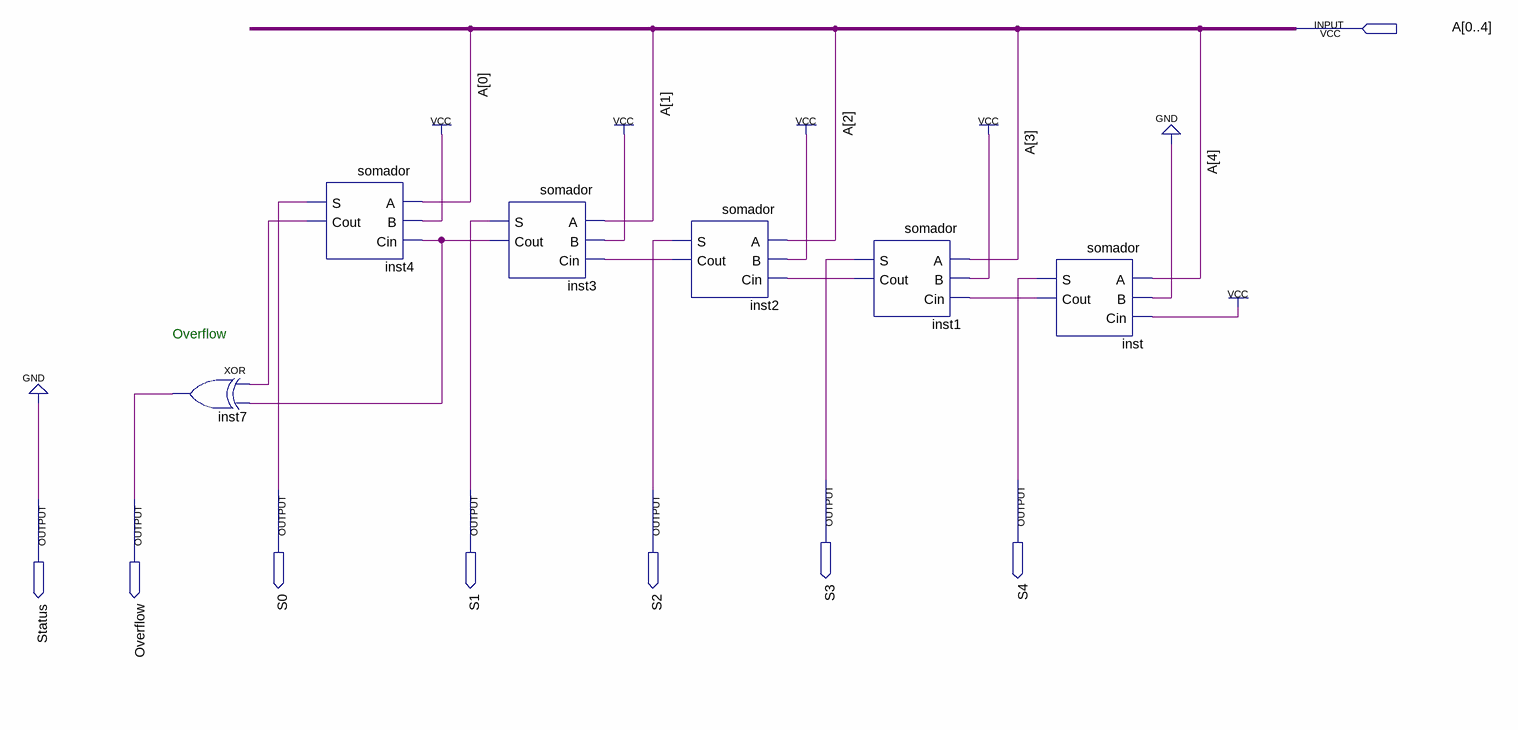
[diagram p0: schematic sheet]
// Quartus schematic subtrator-A-1.bdf as structural Verilog: 6 symbols, 8 pins
module \subtrator-A-1  (
  input  [0:4] A,
  output S3,
  output S4,
  output S0,
  output S1,
  output S2,
  output Status,
  output Overflow
);

  wire inst1_cout, inst2_cout, inst3_cout, inst4_cout, inst_cout;

  xor inst7 (Overflow, inst4_cout, inst3_cout);
  somador inst4 (.A(A[0]), .B(1'b1), .Cin(inst3_cout), .S(S0), .Cout(inst4_cout));
  somador inst3 (.A(A[1]), .B(1'b1), .Cin(inst2_cout), .S(S1), .Cout(inst3_cout));
  somador inst2 (.A(A[2]), .B(1'b1), .Cin(inst1_cout), .S(S2), .Cout(inst2_cout));
  somador inst1 (.A(A[3]), .B(1'b1), .Cin(inst_cout), .S(S3), .Cout(inst1_cout));
  somador inst (.A(A[4]), .B(1'b0), .Cin(1'b1), .S(S4), .Cout(inst_cout));

  assign Status = 1'b0;

  // Notes on the sheet:
  //   Overflow
endmodule
